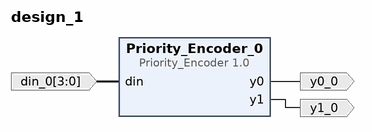
[diagram p0: block diagram of the top level]
# Vivado block design design_1, xc7a35ticpg236-1L, Vivado 2025.1
create_bd_design design_1

create_bd_port -dir I -from 3 -to 0 din_0
create_bd_port -dir O y1_0
create_bd_port -dir O y0_0

create_bd_cell -type ip -vlnv xilinx.com:user:Priority_Encoder:1.0 Priority_Encoder_0

# ---- connections ----

connect_bd_net [get_bd_pins Priority_Encoder_0/y0] [get_bd_ports y0_0]
connect_bd_net [get_bd_pins Priority_Encoder_0/y1] [get_bd_ports y1_0]
connect_bd_net -net din_0_1 [get_bd_ports din_0] [get_bd_pins Priority_Encoder_0/din]

validate_bd_design
save_bd_design
